# Altium schematic sheet architecture.SchDoc: Project architecture and information
size A4; Organization: UFSC; DocumentNumber: 1; SheetNumber: 1; SheetTotal: 8
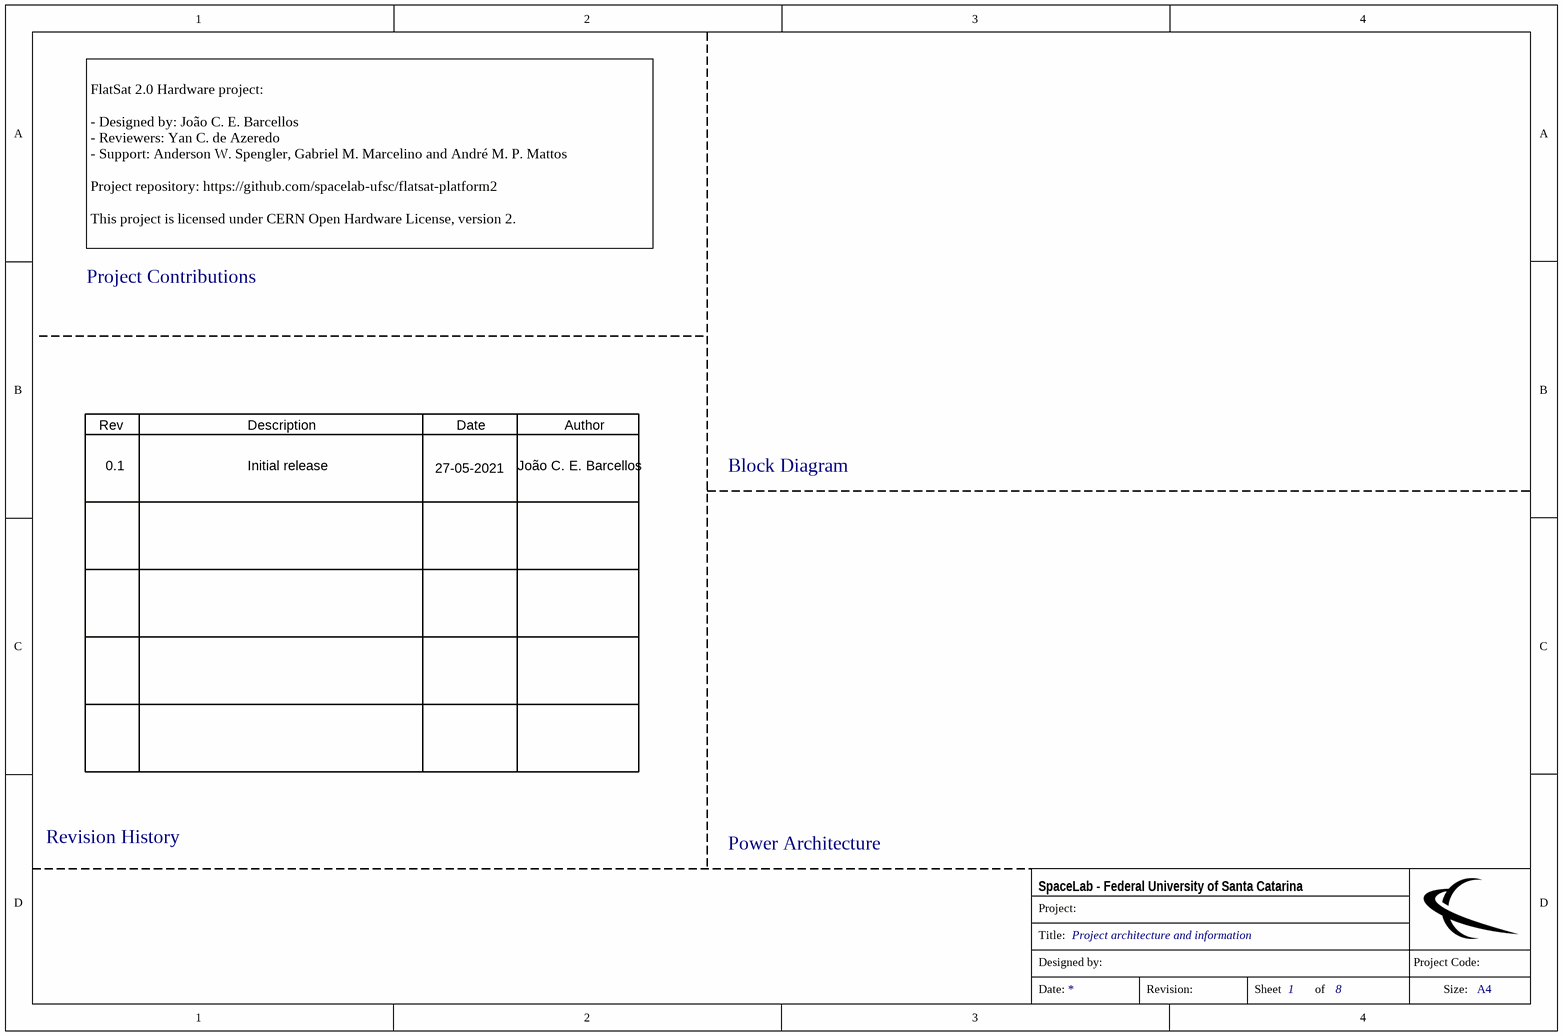
[diagram p0: architecture.SchDoc]

## Notes on the sheet
- FlatSat 2.0 Hardware project:
  - Designed by: João C. E. Barcellos
  - Reviewers: Yan C. de Azeredo
  - Support: Anderson W. Spengler, Gabriel M. Marcelino and André M. P. Mattos
  Project repository: https://github.com/spacelab-ufsc/flatsat-platform2
  This project is licensed under CERN Open Hardware License, version 2.
- Project Contributions
- Rev
- Description
- Date
- Author
- 0.1
- Initial release
- 27-05-2021
- João C. E. Barcellos
- Block Diagram
- Revision History
- Power Architecture
- Project:
- SpaceLab - Federal University of Santa Catarina
- Title:
- Designed by:
- Project Code:
- Date:
- Revision:
- Sheet
- of
- Size:
- A4